# Altium schematic sheet [03] - CPU POWER.SchDoc: CPU POWER
size A4; Organization: Bjørn T. Brodtkorb; Address1: Frode Rinnans veg 161; Address2: 7050 Trondheim; DocumentNumber: 6598; Revision: 1.0; SheetNumber: 1; SheetTotal: 1
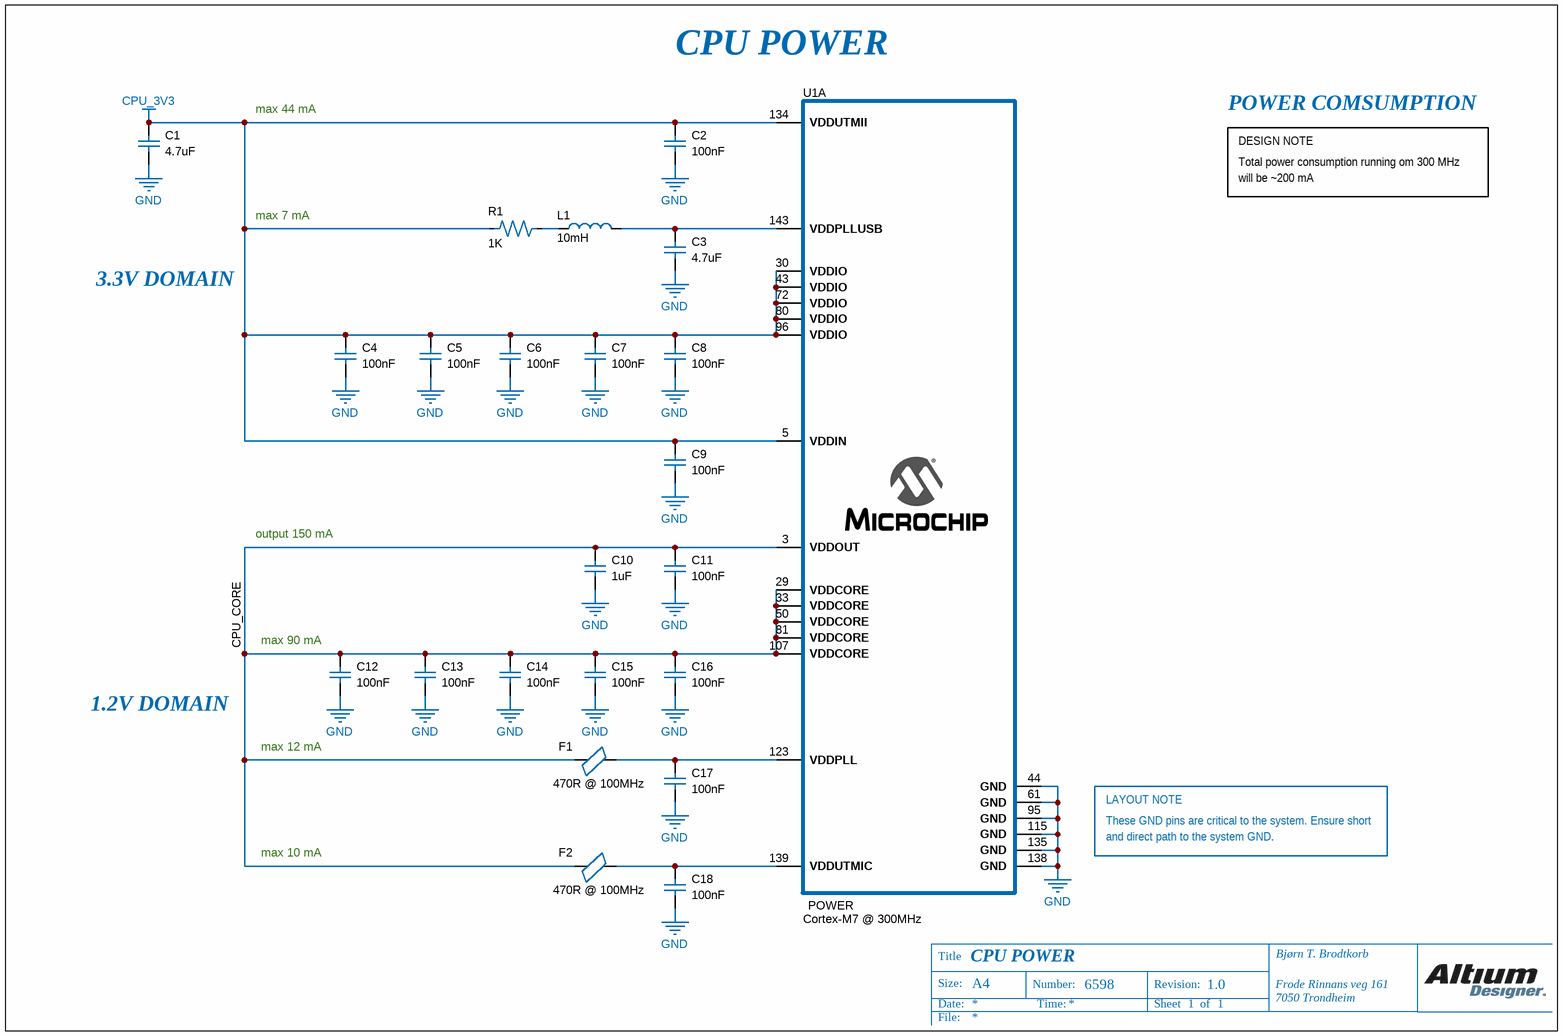
[diagram p0: [03] - CPU POWER.SchDoc]

## Parts
C1  value 4.7uF  [C0603]  (hidden comment: 02016D104KAT2A)
C2  value 100nF  [C0402]  (hidden comment: 04023C103KAT2A)
C3  value 4.7uF  [C0402]  (hidden comment: 04023C103KAT2A)
C4  value 100nF  [C0402]  (hidden comment: 04023C103KAT2A)
C5  value 100nF  [C0402]  (hidden comment: 04023C103KAT2A)
C6  value 100nF  [C0402]  (hidden comment: 04023C103KAT2A)
C7  value 100nF  [C0402]  (hidden comment: 04023C103KAT2A)
C8  value 100nF  [C0402]  (hidden comment: 04023C103KAT2A)
C9  value 100nF  [C0402]  (hidden comment: 04023C103KAT2A)
C10  value 1uF  [C0402]  (hidden comment: 04023C103KAT2A)
C11  value 100nF  [C0402]  (hidden comment: 04023C103KAT2A)
C12  value 100nF  [C0402]  (hidden comment: 04023C103KAT2A)
C13  value 100nF  [C0402]  (hidden comment: 04023C103KAT2A)
C14  value 100nF  [C0402]  (hidden comment: 04023C103KAT2A)
C15  value 100nF  [C0402]  (hidden comment: 04023C103KAT2A)
C16  value 100nF  [C0402]  (hidden comment: 04023C103KAT2A)
C17  value 100nF  [C0402]  (hidden comment: 04023C103KAT2A)
C18  value 100nF  [C0402]  (hidden comment: 04023C103KAT2A)
F1  value 470R @ 100MHz  [Ferrite bead 0402]  (hidden comment: BLM15AG102SN1D)
F2  value 470R @ 100MHz  [Ferrite bead 0402]  (hidden comment: BLM15AG102SN1D)
L1  value 10mH  [Inductor 0603]  (hidden comment: MLZ1608A2R2WT)
R1  value 1K  [R0402]  (hidden comment: CRCW04020000Z0ED)
U1  Cortex-M7 @ 300MHz  [ATSAMS70Q21A-AN]  (part A of 3)

## Nets
CPU_3V3: C1.1 C2.2 C4.2 C5.2 C6.2 C7.2 C8.2 C9.2 R1.1 U1.5(VDDIN) U1.30(VDDIO) U1.43(VDDIO) U1.72(VDDIO) U1.80(VDDIO) U1.96(VDDIO) U1.134(VDDUTMII)
GND: C1.2 C2.1 C3.1 C4.1 C5.1 C6.1 C7.1 C8.1 C9.1 C10.1 C11.1 C12.1 C13.1 C14.1 C15.1 C16.1 C17.1 C18.1 U1.44(GND) U1.61(GND) U1.95(GND) U1.115(GND) U1.135(GND) U1.138(GND)
CPU_CORE: C10.2 C11.2 C12.2 C13.2 C14.2 C15.2 C16.2 F1.1 F2.1 U1.3(VDDOUT) U1.29(VDDCORE) U1.33(VDDCORE) U1.50(VDDCORE) U1.81(VDDCORE) U1.107(VDDCORE)
NetC3_2: C3.2 L1.2 U1.143(VDDPLLUSB)
NetC17_2: C17.2 F1.2 U1.123(VDDPLL)
NetC18_2: C18.2 F2.2 U1.139(VDDUTMIC)
NetL1_1: L1.1 R1.2

## Notes on the sheet
- max 44 mA
- CPU POWER
- POWER COMSUMPTION
- DESIGN NOTE
- Total power consumption running om 300 MHz
- will be ~200 mA
- max 7 mA
- 3.3V DOMAIN
- output 150 mA
- (near C12) max 90 mA
- 1.2V DOMAIN
- (near C12) max 12 mA
- max 10 mA
- LAYOUT NOTE
- These GND pins are critical to the system. Ensure short
- and direct path to the system GND.
- Title
- Size:
- A4
- Number:
- Revision:
- Date:
- File:
- Time:
- Sheet
- of
- (in symbol ATSAMS70Q21A-AN, part A) POWER

## Library data of the parts
C1 = 02016D104KAT2A: C0603
C2-C18 = 04023C103KAT2A: C0402
F1 F2 = BLM15AG102SN1D: Ferrite bead 0402
L1 = MLZ1608A2R2WT: Inductor 0603
R1 = CRCW04020000Z0ED: R0402
U1 = ATSAMS70Q21A-AN: ATSAMS70Q21; Supplier Part Number 1: 2484397; Supplier 1: Farnell